# EAGLE design VCCS_Unit (EAGLE 7.2.0)
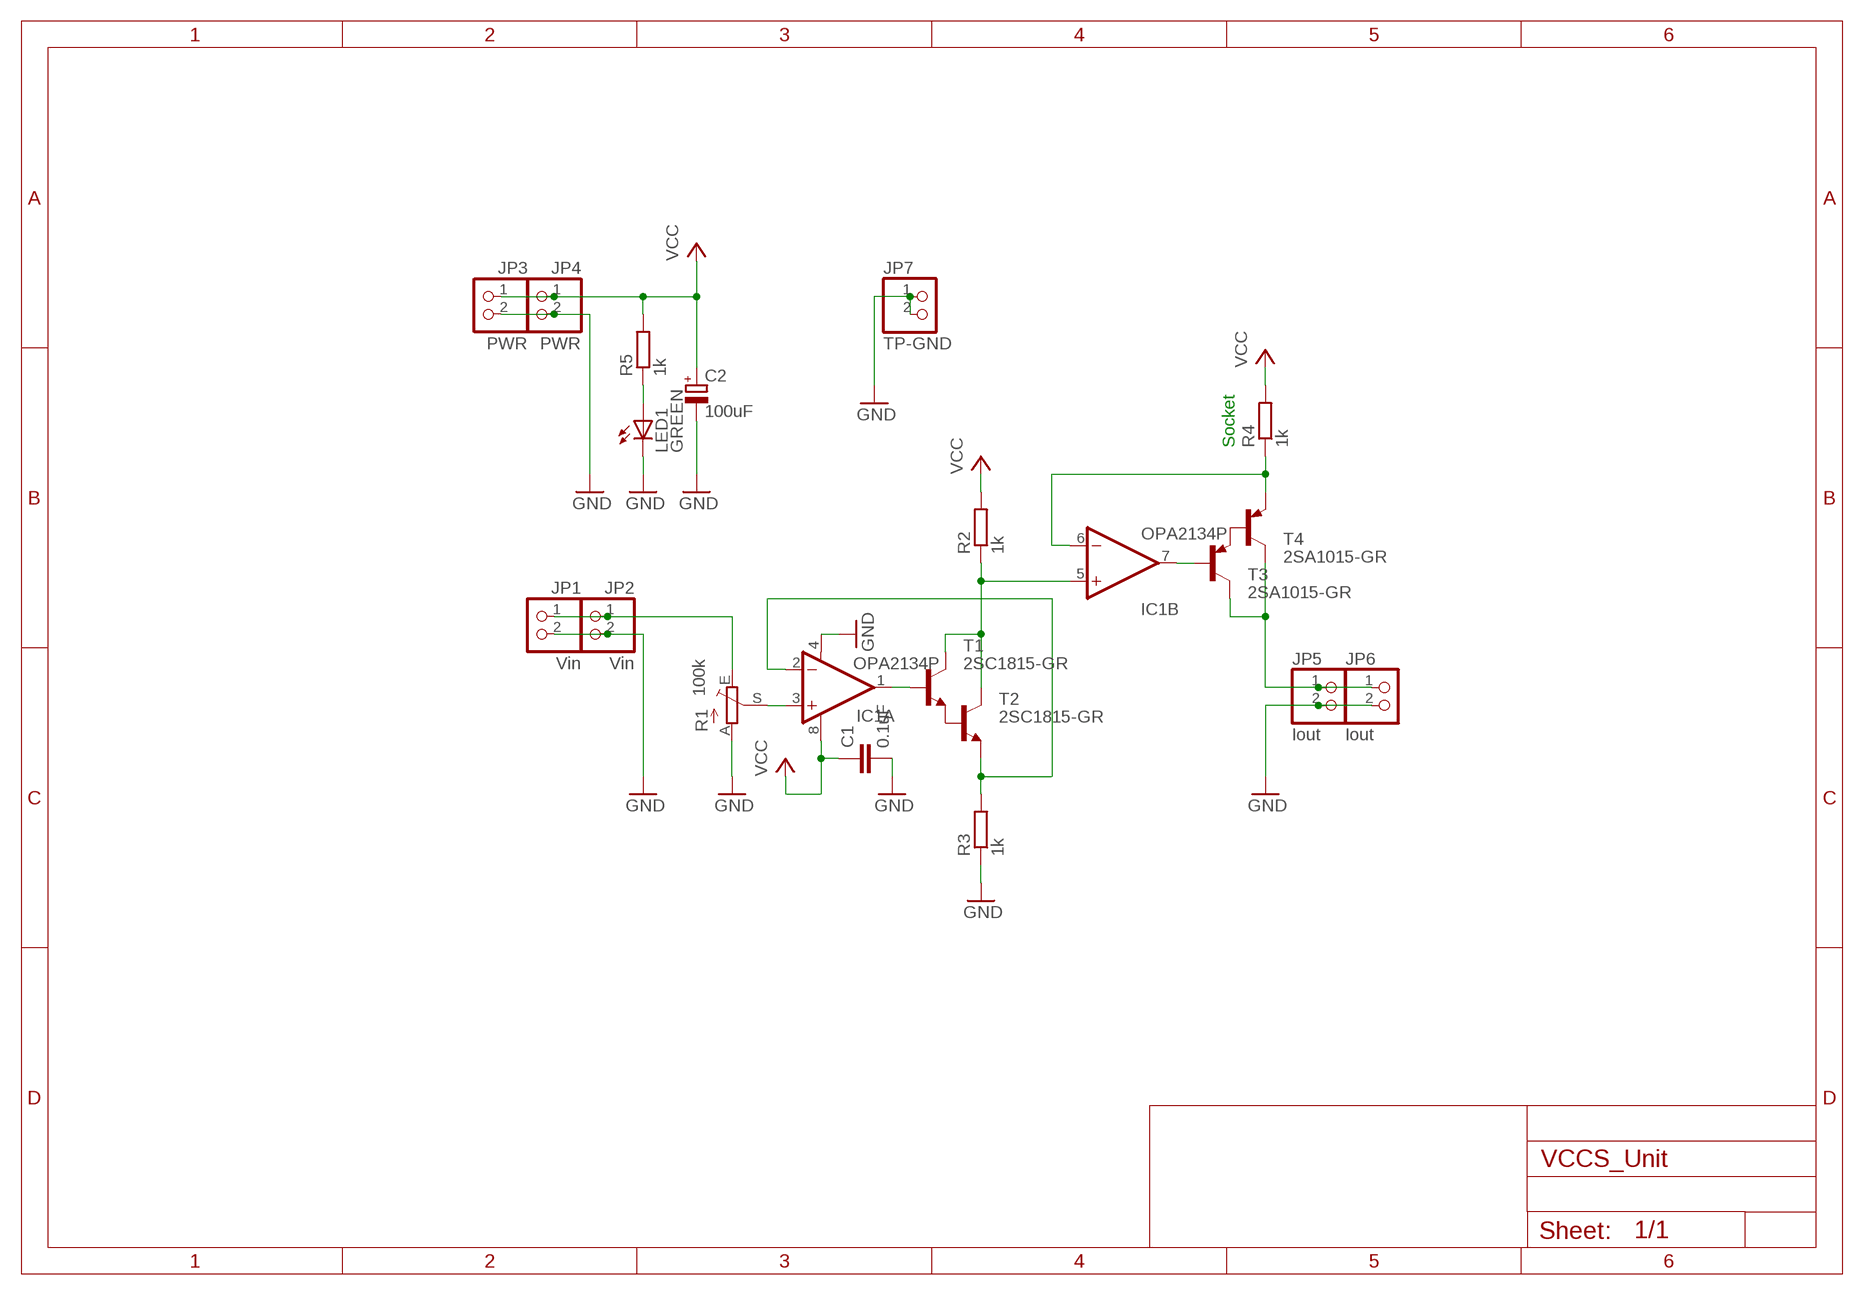
[diagram p0: schematic, sheet 1]

## Parts
C1  0.1uF  C-EU025-024X044  [C025-024X044]
C2  100uF  CPOL-EUE2.5-7  [E2,5-7]
IC1  OPA2134P  [DIL08]
JP1  Vin  PINHD-1X2  [1X02]
JP2  Vin  PINHD-1X2  [1X02]
JP3  PWR  PINHD-1X2  [1X02]
JP4  PWR  PINHD-1X2  [1X02]
JP5  Iout  PINHD-1X2  [1X02]
JP6  Iout  PINHD-1X2  [1X02]
JP7  TP-GND  PINHD-1X2  [1X02]
LED1  GREEN  LED3MM  [LED3MM]
R1  100k  TRIM_EU-B25P  [B25P]
R2  1k  R-EU_0207/7  [0207/7]
R3  1k  R-EU_0207/7  [0207/7]
R4  1k  R-EU_0207/7  [0207/7]
R5  1k  R-EU_0207/7  [0207/7]
T1  2SC1815-GR  -NPN-TO92-ECB  [TO92-ECB]
T2  2SC1815-GR  -NPN-TO92-ECB  [TO92-ECB]
T3  2SA1015-GR  -PNP-TO92-ECB  [TO92-ECB]
T4  2SA1015-GR  -PNP-TO92-ECB  [TO92-ECB]

## Nets
GND: C1.2 C2.- IC1.4(A:V-) JP1.2 JP2.2 JP3.2 JP4.2 JP5.2 JP6.2 JP7.1 JP7.2 LED1.K(C) R1.A R3.1
N$1: T1.E T2.B
N$2: T3.E T4.B
N$3: IC1.2(A:-IN) R3.2 T2.E
N$4: JP1.1 JP2.1 R1.E
N$5: IC1.3(A:+IN) R1.S
N$6: IC1.1(A:OUT) T1.B
N$7: IC1.7(B:OUT) T3.B
N$8: JP5.1 JP6.1 T3.C T4.C
N$9: IC1.5(B:+IN) R2.1 T1.C T2.C
N$10: IC1.6(B:-IN) R4.1 T4.E
N$11: LED1.A R5.1
VCC: C1.1 C2.+ IC1.8(A:V+) JP3.1 JP4.1 R2.2 R4.2 R5.2

## Notes on the sheet
- Socket

## Library data of the parts
C1 = rcl:C-EU: CAPACITOR, European symbol
C2 = rcl:CPOL-EU: POLARIZED CAPACITOR, European symbol
IC1 = burr-brown:OPA2134: Operational Amplifier; MF: TEXAS INSTRUMENTS; MPN: OPA2134PA; OC_FARNELL: 1097574; OC_NEWARK: 74K3897
JP1-JP7 = pinhead:PINHD-1X2: PIN HEADER
LED1 = led:LED: LED OSRAM: - CHIPLED LG R971, LG N971, LY N971, LG Q971, LY Q971, LO R971, LY R971 LH N974, LH R974 LS Q976, LO Q976, LY Q976 LO Q996 - Hyper CHIPLED LW Q18S LB Q993, LB Q99A, LB R99A - SideLED LS A670, LO A670, LY A670, LG A670, LP A670 LB A673, LV A673, LT A673, LW A673 LH A674 LY A675 LS A676, LA A676, LO A676, LY A676, LW A676 LS A679, LY A679, LG A679 - Hyper Micro SIDELED® LS Y876, LA Y876, LO Y876, LY Y876 LT Y87S - SmartLED LW L88C, LW L88S LB L89C, LB L89S, LG L890 LS L89K, LO L89K, LY L89K LS L896, LA L896, LO L896, LY L896 - TOPLED LS T670, LO T670, LY T670, LG T670, LP T670 LSG T670, LSP T670, LSY T670, LOP T670, LYG T670 LG T671, LOG T671, LSG T671 LB T673, LV T673, LT T673, LW T673 LH T674 LS T676, LA T676, LO T676, LY T676, LB T676, LH T676, LSB T676, LW T676 LB T67C, LV T67C, LT T67C, LS T67K, LO T67K, LY T67K, LW E67C LS E67B, LA E67B, LO E67B, LY E67B, LB E67C, LV E67C, LT E67C LW T67C LS T679, LY T679, LG T679 LS T770, LO T770, LY T770, LG T770, LP T770 LB T773, LV T773, LT T773, LW T773 LH T774 LS E675, LA E675, LY E675, LS T675 LS T776, LA T776, LO T776, LY T776, LB T776 LHGB T686 LT T68C, LB T68C - Hyper Mini TOPLED® LB M676 - Mini TOPLED Santana® LG M470 LS M47K, LO M47K, LY M47K Source: http://www.osram.convergy.de LUXEON: - LUMILED® LXK2-PW12-R00, LXK2-PW12-S00, LXK2-PW14-U00, LXK2-PW14-V00 LXK2-PM12-R00, LXK2-PM12-S00, LXK2-PM14-U00 LXK2-PE12-Q00, LXK2-PE12-R00, LXK2-PE12-S00, LXK2-PE14-T00, LXK2-PE14-U00 LXK2-PB12-K00, LXK2-PB12-L00, LXK2-PB12-M00, LXK2-PB14-N00, LXK2-PB14-P00, LXK2-PB14-Q00 LXK2-PR12-L00, LXK2-PR12-M00, LXK2-PR14-Q00, LXK2-PR14-R00 LXK2-PD12-Q00, LXK2-PD12-R00, LXK2-PD12-S00 LXK2-PH12-R00, LXK2-PH12-S00 LXK2-PL12-P00, LXK2-PL12-Q00, LXK2-PL12-R00 Source: www.luxeon.com KINGBRIGHT: KA-3528ASYC Source: www.kingbright.com
R1 = pot:TRIM_EU-: POTENTIOMETER
R2-R5 = rcl:R-EU_: RESISTOR, European symbol
T1 T2 = transistor:*-NPN-: NPN Transistror BF959 corrected 2008.03.06
T3 T4 = transistor-neu-to92:*-PNP-: PNP Transistror

## Board
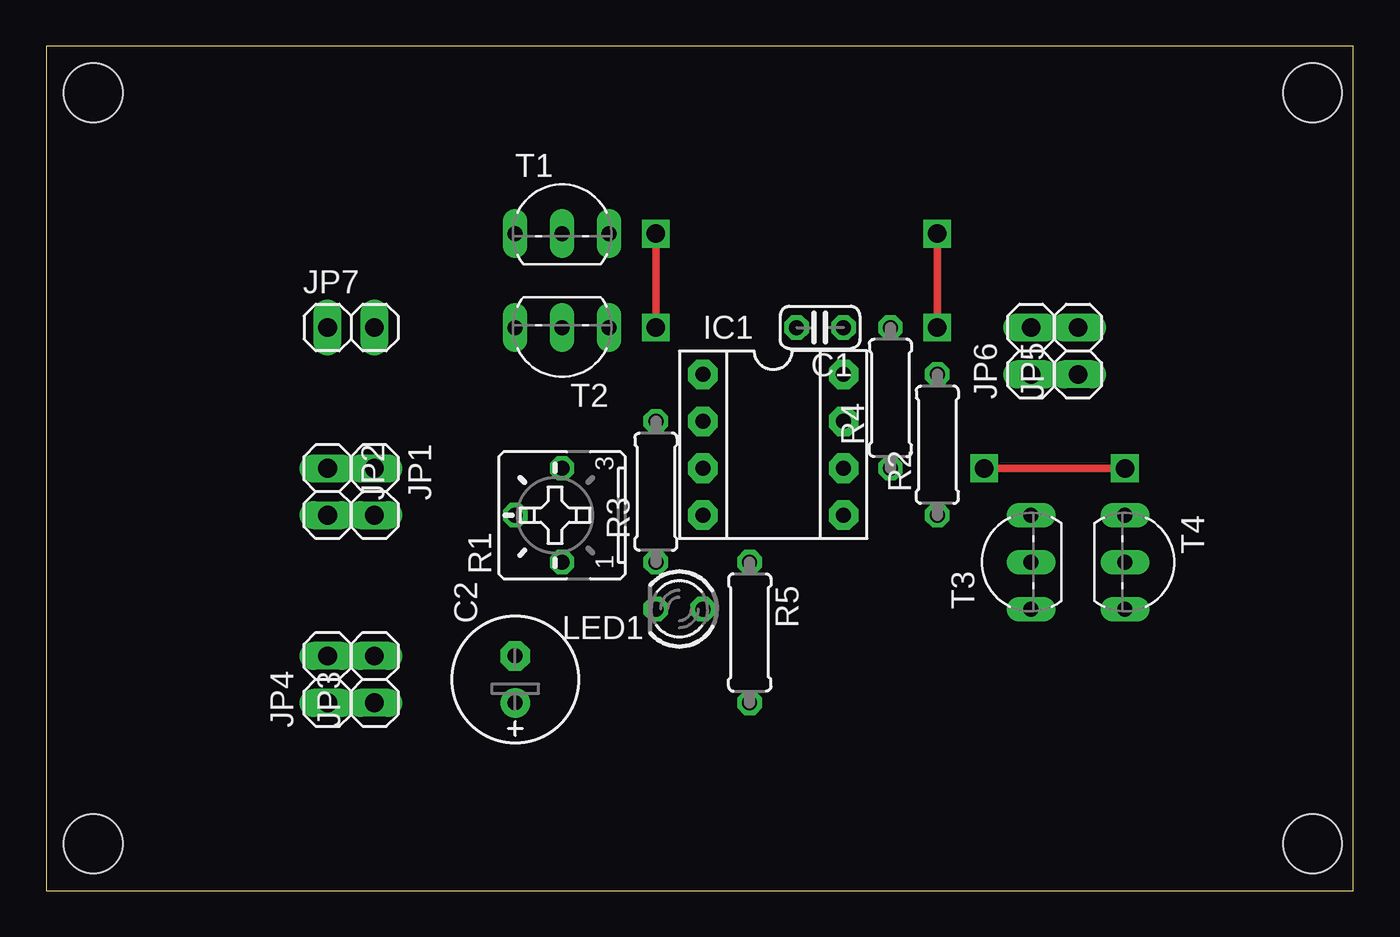
[diagram p1: board, top side]
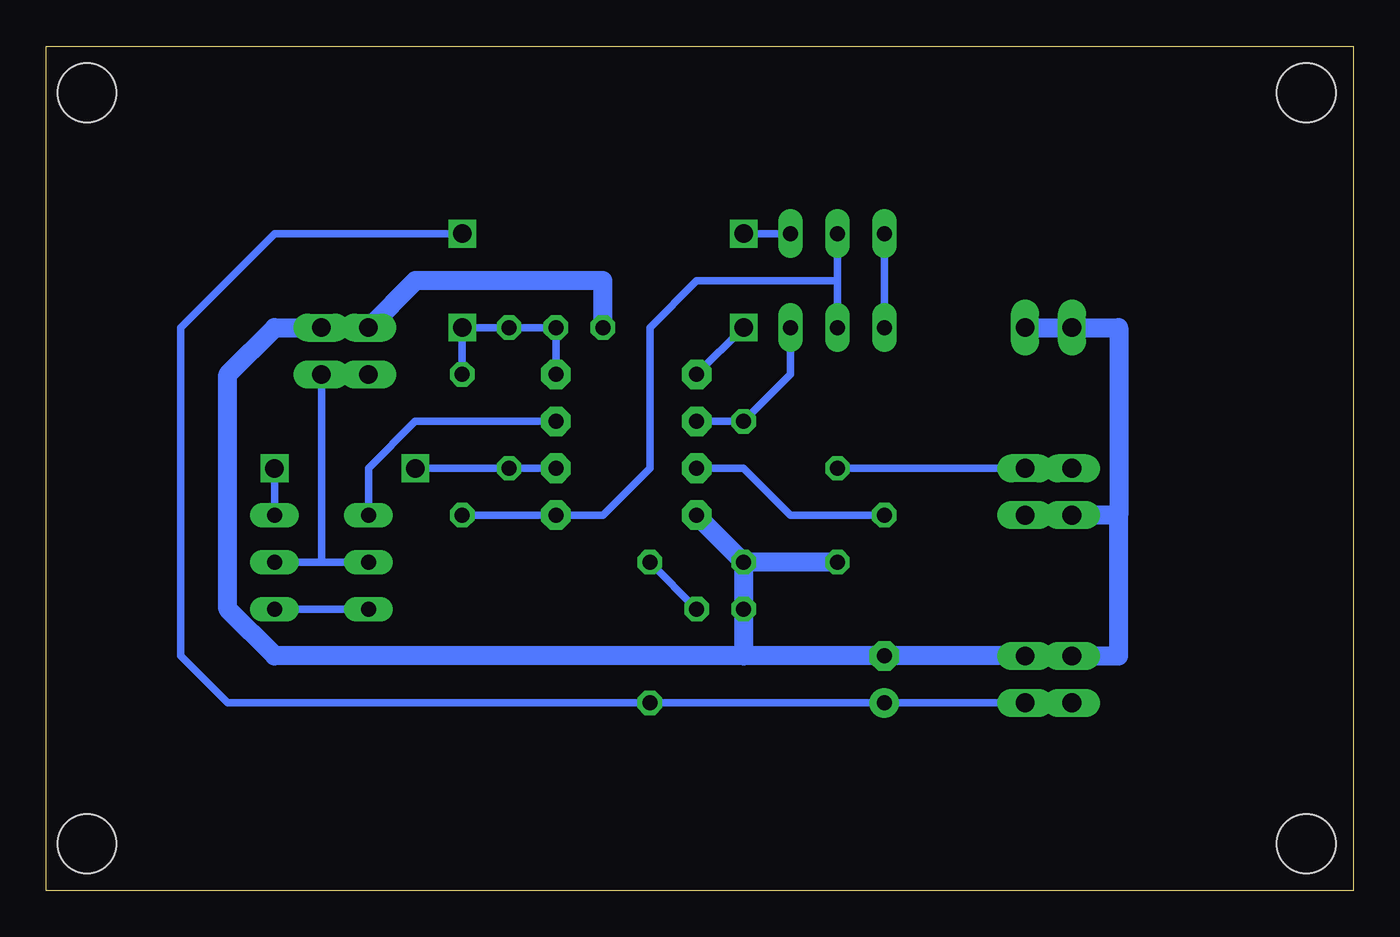
[diagram p2: board, bottom side, seen from below]

Size 70.79 x 45.71 mm. Coordinates in mm from the lower left corner, seen from the top.
Outline: 0,0 70.79,0 70.79,45.71 0,45.71 0,0
Copper layers (1*16): Top 0.035mm / dielectric 1.5mm / Bottom 0.035mm
Design rules "default": minimum track width 10mil, minimum drill 24mil, track to track 8mil, track to pad 8mil, pad to pad 8mil, via to via 8mil, smd to smd 8mil, copper to edge 40mil, drill to drill 8mil, minimum pad ring 10mil, minimum via ring 8mil, stop-mask expansion 4mil, vias tented up to drill 0mil, thermal gap 10mil
Holes 3.2 mm at 2.54,43.18 2.54,2.54 68.58,43.18 68.58,2.54

### Footprints (pad centres in the part's own frame; a part is rotated, then mirrored left to right if it is on the bottom)
C025-024X044 = drill 0.813 octagon: 1 -1.27,0; 2 1.27,0
E2,5-7 = drill 0.813 pad 1.6: + -1.27,0 | drill 0.813 pad 1.6 octagon: - 1.27,0
DIL08 = drill 0.813 pad 1.6 octagon: 1 -3.81,-3.81; 2 -1.27,-3.81; 3 1.27,-3.81; 4 3.81,-3.81; 5 3.81,3.81; 6 1.27,3.81; 7 -1.27,3.81; 8 -3.81,3.81
1X02 = drill 1.016 long: 1 -1.27,0; 2 1.27,0
LED3MM = drill 0.813 octagon: A -1.27,0; K 1.27,0
B25P = drill 0.813 octagon: A -2.54,0; E 2.54,0; S 0,2.54
0207/7 = drill 0.813 octagon: 1 -3.81,0; 2 3.81,0
TO92-ECB = drill 0.813 long: B 2.54,0; C 0,0; E -2.54,0

### Placement (x,y rotation side)
C1  41.91,30.48 180 top
C2  25.4,11.43 90 top
IC1  39.37,24.13 270 top
JP1  17.78,21.59 270 top
JP2  15.24,21.59 270 top
JP3  17.78,11.43 90 top
JP4  15.24,11.43 90 top
JP5  55.88,29.21 90 top
JP6  53.34,29.21 90 top
JP7  16.51,30.48 0 top
LED1  34.29,15.24 180 top
R1  27.94,20.32 90 top
R2  48.26,24.13 90 top
R3  33.02,21.59 90 top
R4  45.72,26.67 90 top
R5  38.1,13.97 270 top
T1  27.94,35.56 0 top
T2  27.94,30.48 180 top
T3  53.34,17.78 90 top
T4  58.42,17.78 270 top

### Tracks (layer width: path | path; a pad name or v marks a point on that pad's centre or on a via)
GND
  Bottom 0.406: JP4.2 JP3.2 | JP7.1 JP7.2
  Bottom 1.016: R3.1 IC1.4 | C1.2 40.64,33.02 50.8,33.02 JP6.2 JP5.2 58.42,30.48 60.96,27.94 60.96,15.24 58.42,12.7 33.02,12.7 | 33.02,12.7 LED1.K R3.1 | JP1.2 JP2.2 12.7,20.32 | JP7.2 12.7,30.48 12.7,20.32 | 12.7,20.32 12.7,12.7 JP3.2 C2.- 33.02,12.7 | R1.A R3.1
N$1
  Bottom 0.406: T1.E T2.B
N$2
  Bottom 0.406: T3.E T4.B
N$3
  Bottom 0.406: IC1.2 R3.2 30.48,27.94 T2.E
N$4
  Bottom 0.406: JP2.1 JP1.1 R1.E
N$5
  Bottom 0.406: IC1.3 33.02,22.86 30.48,20.32 R1.S
N$6  (via drill 1)
  Top 0.406: v33.02,30.48 v33.02,35.56
  Bottom 0.406: v33.02,35.56 T1.B | IC1.1 v33.02,30.48
N$7
  Bottom 0.406: T3.B 53.34,22.86 50.8,25.4 IC1.7
N$8
  Bottom 0.406: JP6.1 JP5.1 55.88,17.78 | T3.C 55.88,17.78 | T4.C 55.88,17.78
N$9
  Bottom 0.406: 27.94,33.02 35.56,33.02 38.1,30.48 38.1,22.86 40.64,20.32 IC1.5 R2.1 | 27.94,33.02 T2.C | T1.C 27.94,33.02
N$10  (via drill 1)
  Top 0.406: v50.8,22.86 v58.42,22.86
  Bottom 0.406: IC1.6 R4.1 v50.8,22.86 | v58.42,22.86 T4.E
N$11
  Bottom 0.406: R5.1 LED1.A
VCC  (via drill 1)
  Top 0.406: v48.26,35.56 v48.26,30.48
  Bottom 0.406: IC1.8 C1.1 R4.2 v48.26,30.48 R2.2 | v48.26,35.56 58.42,35.56 63.5,30.48 63.5,12.7 60.96,10.16 R5.2 C2.+ JP3.1 JP4.1